# Altium schematic sheet MasterRelaySchematic.SchDoc
size A3
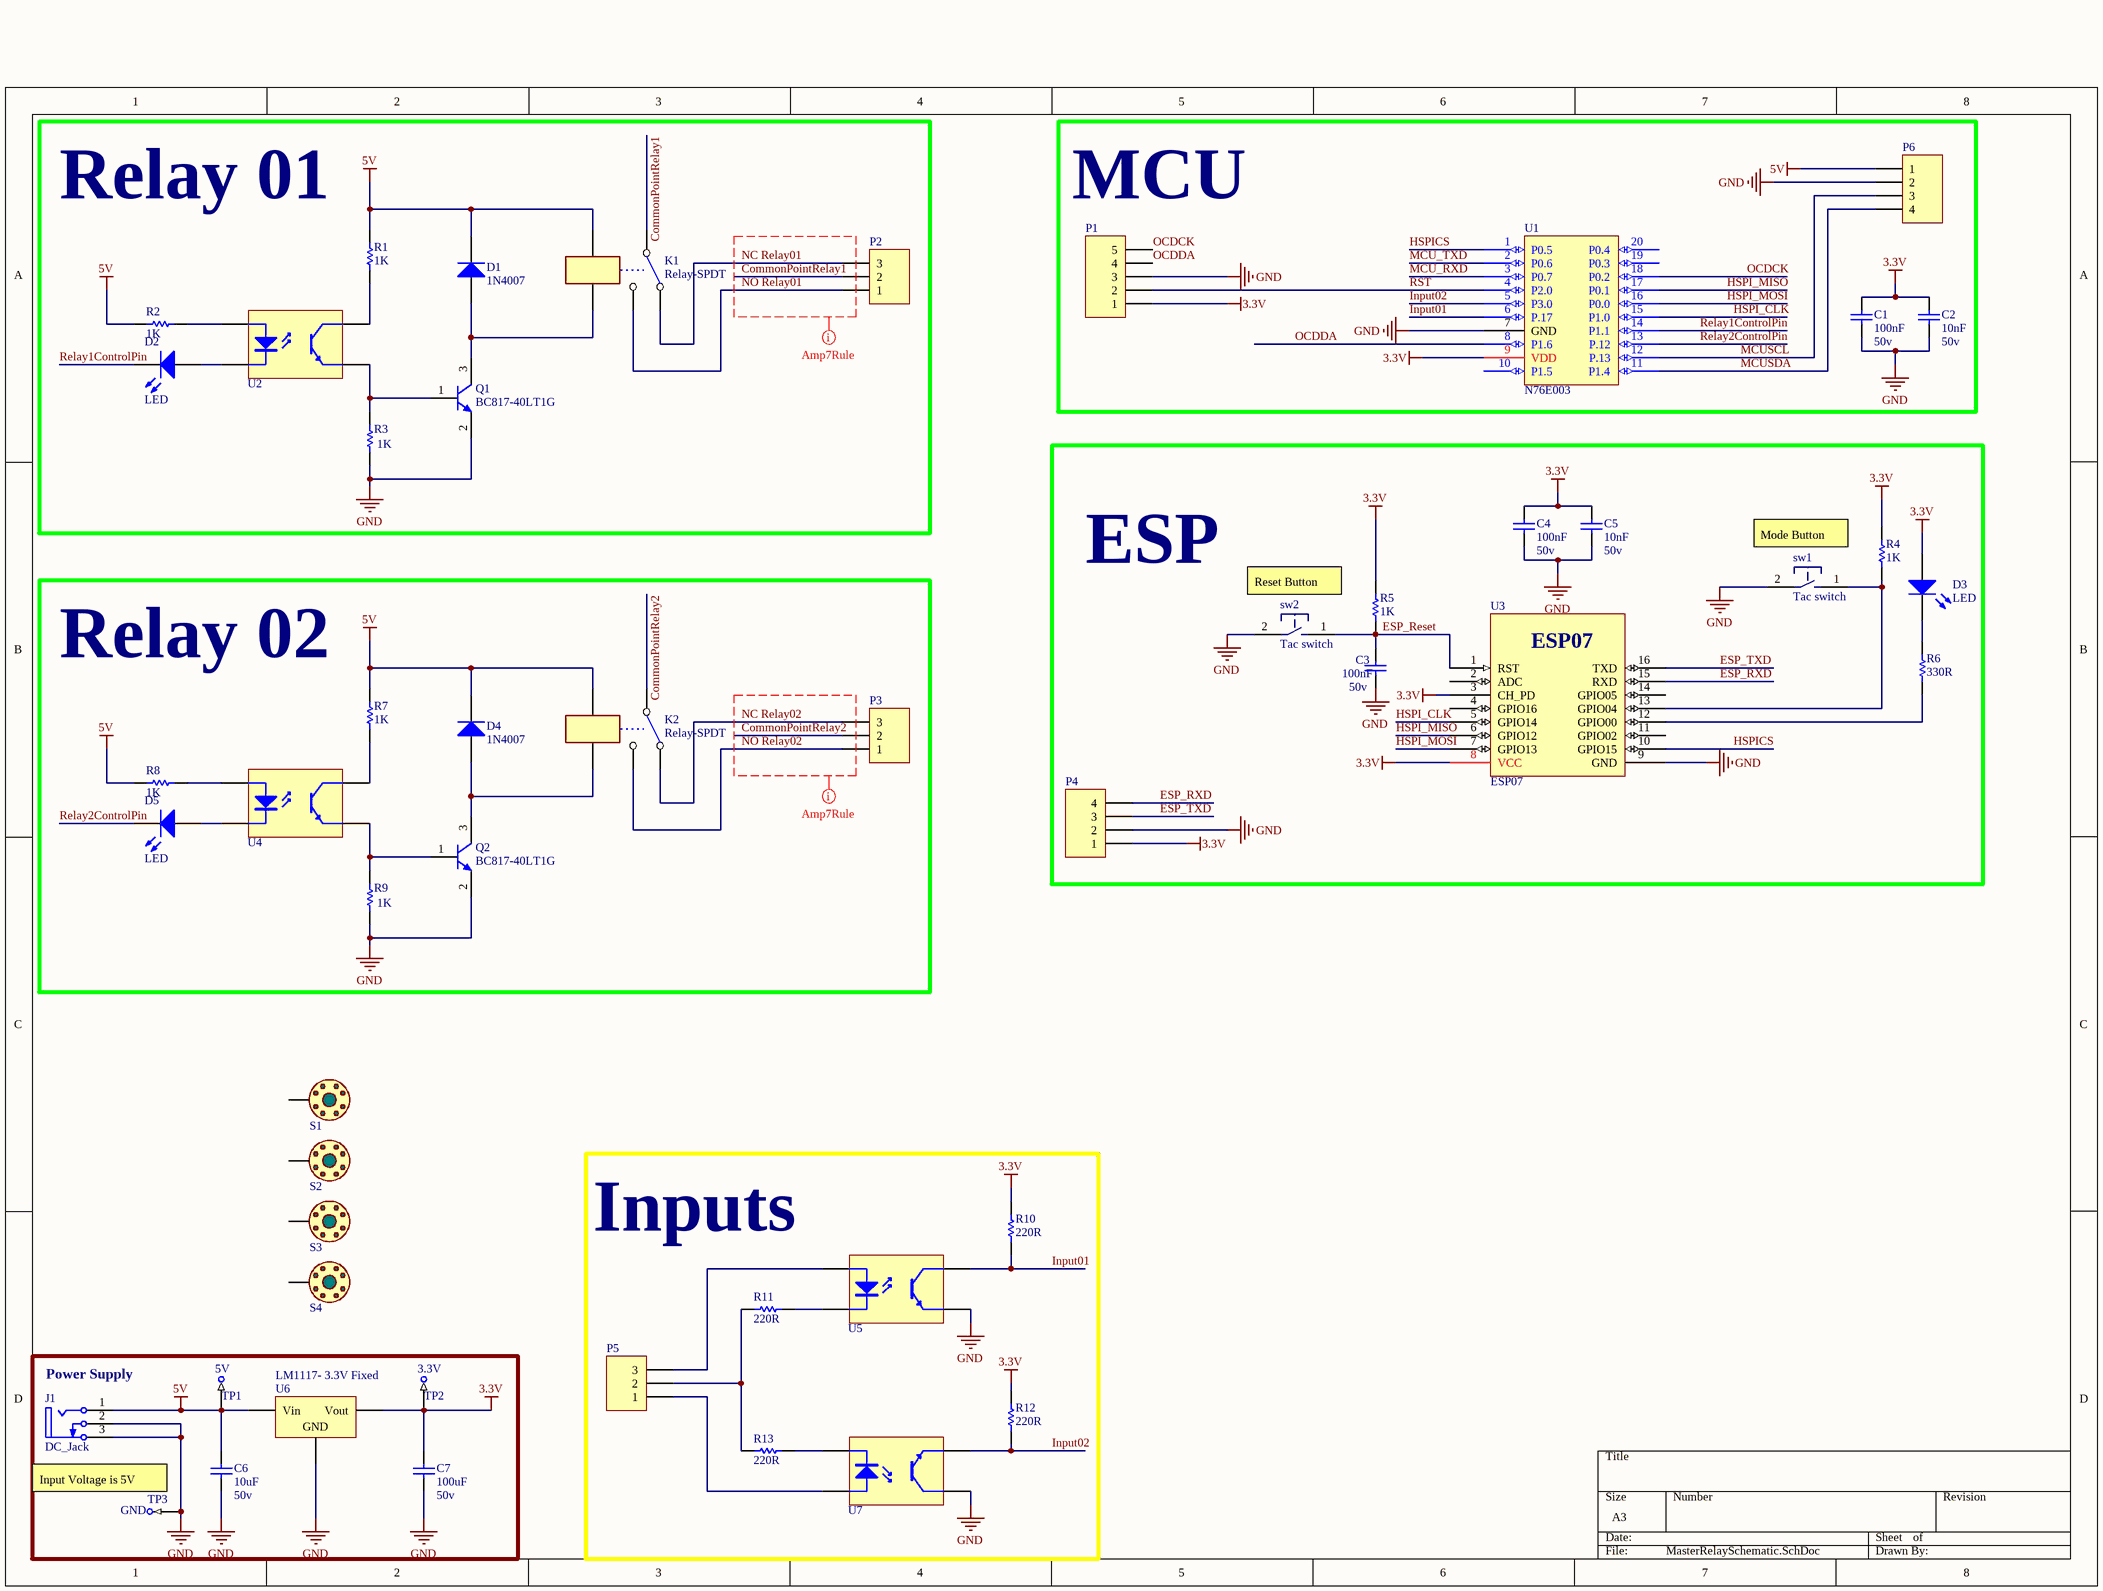
[diagram p0: MasterRelaySchematic.SchDoc]

## Parts
C1  Volte: 50v  [MY_0402]  (hidden comment: 100nF)
C2  Volte: 50v  [MY_0402]  (hidden comment: 10nF)
C3  Volte: 50v  [MY_0805]  (hidden comment: 100nF)
C4  Volte: 50v  [MY_0402]  (hidden comment: 100nF)
C5  Volte: 50v  [MY_0402]  (hidden comment: 10nF)
C6  Volte: 50v  [MY_1210]  (hidden comment: 10uF)
C7  Volte: 50v  [MY_1210]  (hidden comment: 100uF)
D1  1N4007  [MY_1N4007_SMD]
D2  LED  [MY_LED_0805]
D3  LED  [MY_LED_0805]
D4  1N4007  [MY_1N4007_SMD]
D5  LED  [MY_LED_0805]
J1  DC_Jack  [DC_Jack]
K1  Relay-SPDT  [MY_Songle]
K2  Relay-SPDT  [MY_Songle]
P1  Header 5  [My_1X05]  (value not drawn)
P2  Header 3  [MY_MSTBA3]  (value not drawn)
P3  Header 3  [MY_MSTBA3]  (value not drawn)
P4  Header 4  [My_1X04]  (value not drawn)
P5  Header 3  [MY_MSTBA3]  (value not drawn)
P6  Header 4  [MY_FE04W]  (value not drawn)
Q1  BC817-40LT1G  [ONSC-SOT-23-3-318-08_V]
Q2  BC817-40LT1G  [ONSC-SOT-23-3-318-08_V]
R1  1K  [MY_0805]
R2  1K  [MY_0805]
R3  1K  [MY_0805]
R4  1K  [MY_0805]
R5  1K  [MY_0805]
R6  330R  [MY_0805]
R7  1K  [MY_0805]
R8  1K  [MY_0805]
R9  1K  [MY_0805]
R10  220R  [MY_0805]
R11  220R  [MY_0805]
R12  220R  [MY_0805]
R13  220R  [MY_0805]
S1  Screw  [MY_PAD_3MM]  (value not drawn)  (net tie, no BOM)
S2  Screw  [MY_PAD_3MM]  (value not drawn)  (net tie, no BOM)
S3  Screw  [MY_PAD_3MM]  (value not drawn)  (net tie, no BOM)
S4  Screw  [MY_PAD_3MM]  (value not drawn)  (net tie, no BOM)
sw1  Tac switch  [MY_PB-SMD]
sw2  Tac switch  [MY_PB-SMD]
TP1  5V  [MY_TestPin]  (no BOM)
TP2  3.3V  [MY_TestPin]  (no BOM)
TP3  GND  [MY_TestPin]  (no BOM)
U1  N76E003  [TSSOP-20]
U2  Optoisolator  [MY_OPTO_SMD4-7]  (value not drawn)
U3  ESP07  [ESP8266 ESP_7]
U4  Optoisolator  [MY_OPTO_SMD4-7]  (value not drawn)
U5  Optoisolator  [MY_OPTO_SMD4-7]  (value not drawn)
U6  LM1117- 3.3V Fixed  [MY_SOT223]
U7  Optoisolator  [MY_OPTO_SMD4-7]  (value not drawn)

## Blocks framed on the sheet
Relay 01: D1 D2 K1 P2 Q1 R1-R3 U2
MCU: C1 C2 P1 P6 U1
ESP: C3-C5 D3 P4 R4-R6 sw1 sw2 U3
Relay 02: D4 D5 K2 P3 Q2 R7-R9 U4
Inputs: P5 R10-R13 U5 U7
Power Supply: C6 C7 J1 TP1-TP3 U6

## Nets
3.3V: C1.2 C2.2 C4.2 C5.2 C7.1 D3.A P1.1 P4.1 R4.2 R5.2 R10.1 R12.1 TP2.1 U1.9(VDD) U3.3(CH_PD) U3.8(VCC) U6.2(Vout)
5V: C6.1 D1.K D4.K J1.1(VCC) K1.4 K2.4 P6.1 R1.2 R2.1 R7.2 R8.1 TP1.1 U6.3(Vin)
GND: C1.1 C2.1 C3.2 C4.1 C5.1 C6.2 C7.2 J1.2(GND) J1.3(GND) P1.3 P4.2 P6.2 Q1.2(E) Q2.2(E) R3.1 R9.1 sw1.2 sw2.2 TP3.1 U1.7(GND) U3.9(GND) U5.3(E) U6.1(GND) U7.4(C)
CommonPointRelay1: K1.1 P2.2
CommonPointRelay2: K2.1 P3.2
ESP_Reset: C3.1 R5.1 sw2.1 U3.1(RST)
ESP_RXD: P4.4 U3.15(RXD)
ESP_TXD: P4.3 U3.16(TXD)
HSPI_CLK: U1.15(P1.0) U3.5(GPIO14)
HSPI_MISO: U1.17(P0.1) U3.6(GPIO12)
HSPI_MOSI: U1.16(P0.0) U3.7(GPIO13)
HSPICS: U1.1(P0.5) U3.10(GPIO15)
Input01: R10.2 U1.6(P.17) U5.4(C)
Input02: R12.2 U1.5(P3.0) U7.3(E)
MCU_RXD: U1.3(P0.7)
MCU_TXD: U1.2(P0.6)
MCUSCL: P6.3 U1.12(P.13)
MCUSDA: P6.4 U1.11(P1.4)
NC Relay01: K1.2 P2.3
NC Relay02: K2.2 P3.3
NO Relay01: K1.3 P2.1
NO Relay02: K2.3 P3.1
OCDCK: P1.5 U1.18(P0.2)
OCDDA: P1.4 U1.8(P1.6)
Relay1ControlPin: D2.K U1.14(P1.1)
Relay2ControlPin: D5.K U1.13(P.12)
RST: P1.2 U1.4(P2.0)
NetD1_A: D1.A K1.5 Q1.3(C)
NetD2_A: D2.A U2.2(K)
NetD3_K: D3.K R6.2
NetD4_A: D4.A K2.5 Q2.3(C)
NetD5_A: D5.A U4.2(K)
NetP5_1: P5.1 U7.1(A)
NetP5_2: P5.2 R11.2 R13.2
NetP5_3: P5.3 U5.1(A)
NetQ1_1: Q1.1(B) R3.2 U2.3(E)
NetQ2_1: Q2.1(B) R9.2 U4.3(E)
NetR1_1: R1.1 U2.4(C)
NetR2_2: R2.2 U2.1(A)
NetR4_1: R4.1 sw1.1 U3.13(GPIO04)
NetR6_1: R6.1 U3.12(GPIO00)
NetR7_1: R7.1 U4.4(C)
NetR8_2: R8.2 U4.1(A)
NetR11_1: R11.1 U5.2(K)
NetR13_1: R13.1 U7.2(K)

Not connected (* = marked no-connect by the designer): S1 0; S2 0; S3 0; S4 0; U1 10(P1.5) 19(P0.3) 20(P0.4); U3 2(ADC) 4(GPIO16) 11(GPIO02) 14(GPIO05)

## Layout directives
rule Width Constraint [Pref Width = 10mil    Min Width = 80mil    Max Width = 1000mil]; rule Clearance Constraint [Clearance = 32mil]: CommonPointRelay1, CommonPointRelay2, NC Relay01, NC Relay02, NO Relay01, NO Relay02

## Notes on the sheet
- Reset Button
- Mode Button
- Input Voltage is 5V

## Library data of the parts
C1-C7 = Cap ceramic: None polar capacitor; ASiD Part Number: C-AS
  C1 C3 C4: Value: 100nF
  C2 C5: Value: 10nF
  C6: Value: 10uF
  C7: Value: 100uF
D1 D4 = 1N4007: 1 Amp Diode; ASiD Part Number: 1n4007-AS
D2 D3 D5 = LED: Typical INFRARED GaAs LED; ASiD Part Number: LED-AS
J1 = DC_Jack: PackageDocument: 2003; PCB_Layout: Complies with manufacturer's recommendation.; DrillAndSlotSize: Corresponds to nominal value.; LatestRevisionDate: 15-Jul-2004; LatestRevisionNote: Component Replaced & renamed from "Phonejack".; DatasheetDocument: 2003; PackageReference: S1VS_SNB; Publisher: Altium Limited; ComponentLink1Description: Manufacturer Link; ComponentLink1URL: http://www.cliffuk.co.uk/
K1 K2 = Relay-SPDT: Standard single contact relay; ASiD Part Number: Relay-SPDT-AS
P1 = Header 5: Header, 5-Pin; ASiD Part Number: Header 5-AS
P2 P3 P5 = Header 3: Header, 3-Pin; ASiD Part Number: Header 3-AS
P4 P6 = Header 4: Header, 4-Pin; ASiD Part Number: Header 4-AS
Q1 Q2 = CMP-1048-00019-1: General Purpose Transistor, NPN Silicon, 3-Pin SOT-23, Pb-Free, Tape and Reel; Manufacturer: On Semiconductor; fT Min (MHz): 100; IC Continuous (A): 0.5; ComponentLink2URL: http://www.onsemi.com/pub_link/Collateral/BC817-16LT1-D.PDF; DatasheetVersion: Rev. 12; ComponentLink3URL: http://www.onsemi.cn/pub_link/Collateral/318-08.PDF; ComponentLink3Description: Package Specification; ComponentLink1Description: Manufacturer URL; Mounting Technology: Surface Mount; ComponentLink1URL: http://www.onsemi.com/; Packing: Tape and Reel; ComponentLink2Description: Datasheet; Polarity: NPN; RoHS: TRUE; PackageVersion: Rev. AP, 11/2009; PartNumber: BC817-40LT1G; PackageDescription: 3-Pin Small Outline Transistor, Body 2.92 x 1.3 mm, Pitch 0.95 mm; PackageReference: SOT-23-3-318-08
R1-R13 = Res: Standard resistor; ASiD Part Number: Res-AS
  R1-R5 R7-R9: Value: 1K
  R6: Value: 330R
  R10-R13: Value: 220R
S1-S4 = Screw: 3mm Screw; ASiD Part Number: Screw-AS
sw1 sw2 = Tac switch: small tac switch; ASiD Part Number: Tac switch-AS
TP1-TP3 = Test Point: ASiD Part Number: Test Point-AS
U2 U4 U5 U7 = Optoisolator: ASiD Part Number: Optoisolator-AS
U6 = LM1117: Low Drop Voltage Reg; ASiD Part Number: LM1117-AS